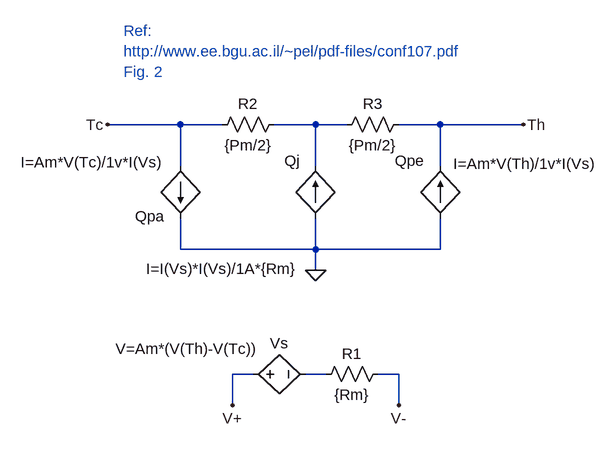
[diagram p0: schematic peltier_c_RmPmAm.asc]
peltier_c_RmPmAm.asc, the LTspice schematic file:
Version 4
SHEET 1 880 680
WIRE -48 -32 -160 -32
WIRE -48 32 -48 -32
WIRE -48 160 -48 112
WIRE 16 -32 -48 -32
WIRE 32 400 32 352
WIRE 64 352 32 352
WIRE 160 -32 96 -32
WIRE 160 32 160 -32
WIRE 160 160 -48 160
WIRE 160 160 160 112
WIRE 160 192 160 160
WIRE 176 352 144 352
WIRE 208 -32 160 -32
WIRE 288 352 256 352
WIRE 288 400 288 352
WIRE 352 -32 288 -32
WIRE 352 32 352 -32
WIRE 352 160 160 160
WIRE 352 160 352 112
WIRE 480 -32 352 -32
FLAG 160 192 0
FLAG -160 -32 Tc
FLAG 480 -32 Th
FLAG 32 400 V+
FLAG 288 400 V-
SYMBOL bv 48 352 R270
WINDOW 0 32 56 VTop 0
WINDOW 3 55 -86 VBottom 0
SYMATTR InstName Vs
SYMATTR Value V=Am*(V(Th)-V(Tc))
SYMBOL res 272 336 R90
WINDOW 0 0 56 VBottom 0
WINDOW 3 32 56 VTop 0
SYMATTR InstName R1
SYMATTR Value {Rm}
SYMBOL bi 160 112 R180
WINDOW 0 24 88 Left 0
WINDOW 3 30 -78 Left 0
SYMATTR InstName Qj
SYMATTR Value I=I(Vs)*I(Vs)/1A*{Rm}
SYMBOL bi -48 32 R0
WINDOW 0 -70 77 Left 0
WINDOW 3 -246 -6 Left 0
SYMATTR InstName Qpa
SYMATTR Value I=Am*V(Tc)/1v*I(Vs)
SYMBOL bi 352 112 R180
WINDOW 0 24 88 Left 0
WINDOW 3 -239 84 Left 0
SYMATTR InstName Qpe
SYMATTR Value I=Am*V(Th)/1v*I(Vs)
SYMBOL res 112 -48 R90
WINDOW 0 0 56 VBottom 0
WINDOW 3 32 56 VTop 0
SYMATTR InstName R2
SYMATTR Value {Pm/2}
SYMBOL res 304 -48 R90
WINDOW 0 0 56 VBottom 0
WINDOW 3 32 56 VTop 0
SYMATTR InstName R3
SYMATTR Value {Pm/2}
TEXT -136 -176 Left 0 ;Ref:\nhttp://www.ee.bgu.ac.il/~pel/pdf-files/conf107.pdf\nFig. 2

The netlist it stands for:
* peltier_c_RmPmAm.asc
B§Vs V+ N002 V=Am*(V(Th)-V(Tc))
R1 V- N002 {Rm}
B§Qj 0 N001 I=I(Vs)*I(Vs)/1A*{Rm}
B§Qpa Tc 0 I=Am*V(Tc)/1v*I(Vs)
B§Qpe 0 Th I=Am*V(Th)/1v*I(Vs)
R2 N001 Tc {Pm/2}
R3 Th N001 {Pm/2}
* Ref:
* http://www.ee.bgu.ac.il/~pel/pdf-files/conf107.pdf
* Fig. 2
.backanno
.end